# EAGLE design skpcbs custom uno (EAGLE 9.3.2)
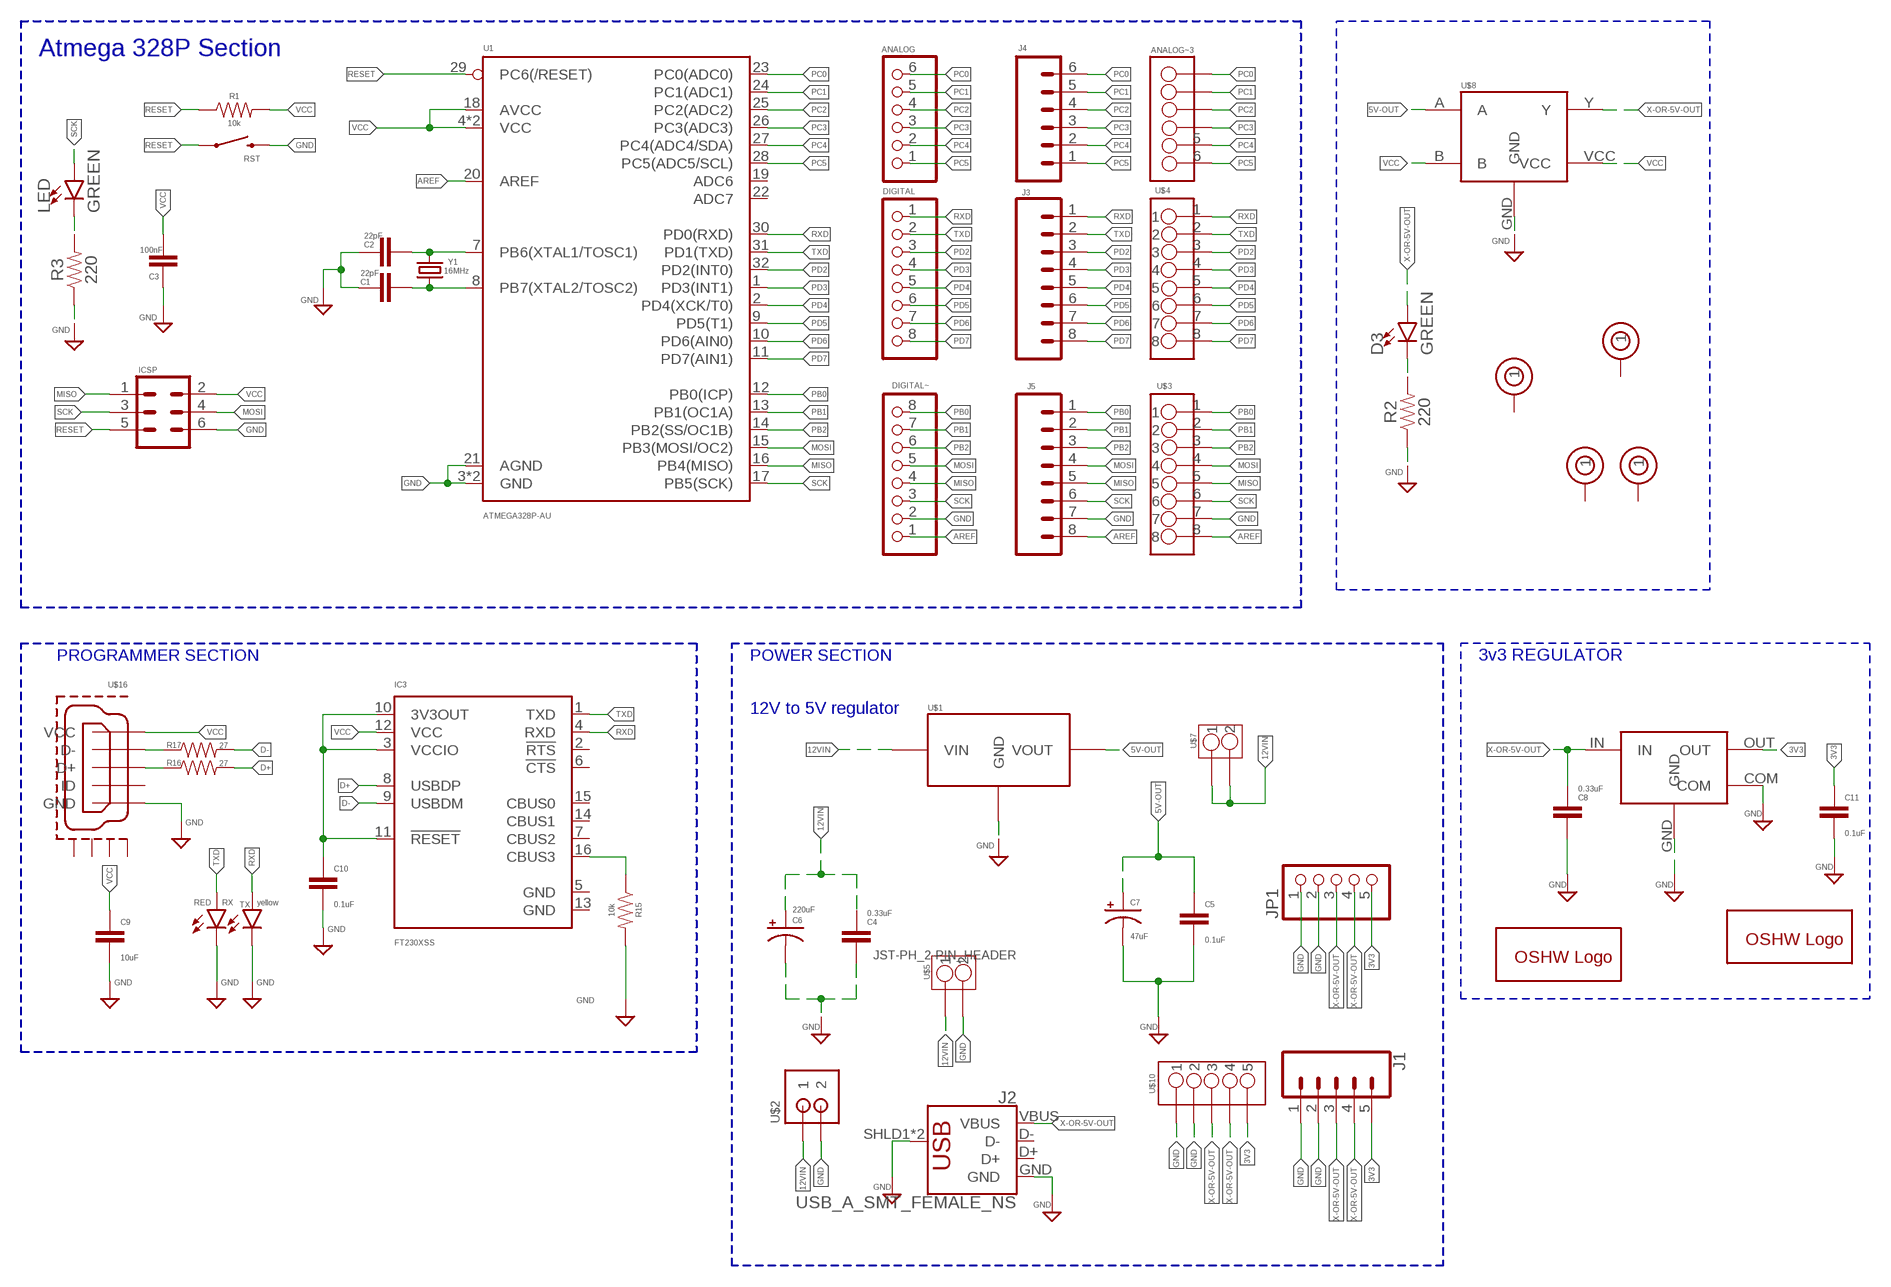
[diagram p0: schematic, sheet 1]

## Parts
ANALOG  PINHD-1X6  [1X06]
ANALOG~3  TERMINAL-BLOCKS-2.54MM-6PINS  [TERMINAL-BLOCK-2.54MM-6PINS]
C1  22pF  22PF-0603-50V-5%  [0603]
C2  22pF  22PF-0603-50V-5%  [0603]
C3  100nF  10NF-0603-50V-10%  [0603]
C4  0.33uF  0.1UF-0603-25V-5%  [0603]
C5  0.1uF  0.1UF-0603-25V-5%  [0603]
C6  220uF  CPOL-US153CLV-0605  [153CLV-0605]
C7  47uF  CPOL-US153CLV-0605  [153CLV-0605]
C8  0.33uF  0.1UF-0603-25V-5%  [0603]
C9  10uF  10UF-0603-6.3V-20%  [0603]
C10  0.1uF  0.1UF-0603-25V-(+80/-20%)  [0603]
C11  0.1uF  0.1UF-0603-25V-5%  [0603]
D3  GREEN  LED-GREEN0603  [LED-0603]
DIGITAL  PINHD-1X8  [1X08]
DIGITAL~  PINHD-1X8  [1X08]
GOLD_ORB_SM1  OSHWLOGOLOGO8MM  [OSHW_8MM]
GOLD_ORB_SM2  OSHWLOGOLOGO8MM  [OSHW_8MM]
IC3  FT230XSS  [SSOP16]
ICSP  CONN_03X2SHROUD  [2X3-SHROUDED]
J1  CONN_05NO_SILK  [1X05_NO_SILK]
J2  USB_A_SMT_FEMALE_NS  [USB-A-S-NOSILK-FEMALE]
J3  CONN_08NO_SILK_FEMALE_PTH  [1X08_NO_SILK]
J4  CONN_06NO_SILK_FEMALE_PTH  [1X06_NO_SILK]
J5  CONN_08NO_SILK_FEMALE_PTH  [1X08_NO_SILK]
JP1  PINHD-1X5  [1X05]
LED  GREEN  LED-GREEN1206  [LED-1206]
R1  10k  10KOHM-0603-1/10W-1%  [0603]
R2  220  220OHM-0603-1/10W-1%  [0603]
R3  220  220OHM-0603-1/10W-1%  [0603]
R15  10k  1.2MOHM-0603-1/10W-1%  [0603]
R16  27  27OHM-0603-1/10W-1%  [0603]
R17  27  27OHM-0603-1/10W-1%  [0603]
RST  MOMENTARY-SWITCH-SPST-SMD-5.2MM  [TACTILE_SWITCH_SMD_5.2MM]
RX  RED  LED-RED1206  [LED-1206]
TX  yellow  LED-RED1206  [LED-1206]
U1  ATMEGA328P-AU  ATMEGA328P_TQFP  [TQFP32-08]
U$1  L78M05CDT-TR  [L78M05CDT-TR]
U$2  JST-PH_2-PIN_HEADER  [JST_B2B-PH_HEADER]
U$3  TERMINAL-BLOCK-2.54MM-8PINS  [TERMINAL-BLOCK-2.54MM-8PINS]
U$4  TERMINAL-BLOCK-2.54MM-8PINS  [TERMINAL-BLOCK-2.54MM-8PINS]
U$5  TERMINAL-BLOCK-2.54MM-2PINS  [TERMINAL-BLOCK-2.54MM-2PIN]
U$6  3MM-THROUGH-HOLE  [3MM-THROUGH-HOLE]
U$7  TERMINAL-BLOCK-2.54MM-2PINS  [TERMINAL-BLOCK-2.54MM-2PIN]
U$8  NC7SZ86M5X  [NC7SZ86M5X]
U$9  UA78M33CDCYR  [UA78M33CDCYR]
U$10  TERMINAL-BLOCK-2.54MM-5PINS  [TERMINAL-BLOCK-2.54MM-5PINS]
U$11  3MM-THROUGH-HOLE  [3MM-THROUGH-HOLE]
U$12  3MM-THROUGH-HOLE  [3MM-THROUGH-HOLE]
U$13  3MM-THROUGH-HOLE  [3MM-THROUGH-HOLE]
U$16  MICRO-USB-RECEPTACLE47589-0001  [47589-0001]
Y1  16MHz  CRYSTAL-16MHZSMD-5X3.2  [CRYSTAL-SMD-5X3.2-4PAD]

## Nets
3V3: C11.1 J1.5 JP1.5 U$9.OUT U$10.5
5V-OUT: C5.1 C7.+ U$1.VOUT U$8.A
12VIN: C4.1 C6.+ U$1.VIN U$2.P1 U$5.1 U$7.1 U$7.2
AREF: DIGITAL~.1 J5.8 U1.20(AREF) U$3.8
D+: IC3.8(USBDP) R16.2
D-: IC3.9(USBDM) R17.2
GND: C1.2 C2.1 C3.2 C4.2 C5.2 C6.- C7.- C8.2 C9.2 C10.2 C11.2 DIGITAL~.2 ICSP.6 J1.1 J1.2 J2.GND J2.SHLD1(SHIELD) J2.SHLD2(SHIELD) J5.7 JP1.1 JP1.2 R2.1 R3.1 R15.2 RST.3 RX.C TX.C U1.3(GND) U1.5(GND) U1.21(AGND) U$1.GND U$2.P2 U$3.7 U$5.2 U$8.GND U$9.COM U$9.GND U$10.1 U$10.2 U$16.GND
MISO: DIGITAL~.4 ICSP.1 J5.5 U1.16(PB4(MISO)) U$3.5
MOSI: DIGITAL~.5 ICSP.4 J5.4 U1.15(PB3(MOSI/OC2)) U$3.4
N$1: C2.2 U1.7(PB6(XTAL1/TOSC1)) Y1.3
N$2: C1.1 U1.8(PB7(XTAL2/TOSC2)) Y1.1
N$3: LED.C R3.2
N$4: D3.C R2.2
N$18: IC3.16(CBUS3) R15.1
N$19: C10.1 IC3.3(VCCIO) IC3.10(3V3OUT) IC3.11(!RESET)
N$20: R16.1 U$16.D+
N$21: R17.1 U$16.D-
PB0: DIGITAL~.8 J5.1 U1.12(PB0(ICP)) U$3.1
PB1: DIGITAL~.7 J5.2 U1.13(PB1(OC1A)) U$3.2
PB2: DIGITAL~.6 J5.3 U1.14(PB2(SS/OC1B)) U$3.3
PC0: ANALOG.6 ANALOG~3.1 J4.6 U1.23(PC0(ADC0))
PC1: ANALOG.5 ANALOG~3.2 J4.5 U1.24(PC1(ADC1))
PC2: ANALOG.4 ANALOG~3.3 J4.4 U1.25(PC2(ADC2))
PC3: ANALOG.3 ANALOG~3.4 J4.3 U1.26(PC3(ADC3))
PC4: ANALOG.2 ANALOG~3.5 J4.2 U1.27(PC4(ADC4/SDA))
PC5: ANALOG.1 ANALOG~3.6 J4.1 U1.28(PC5(ADC5/SCL))
PD2: DIGITAL.3 J3.3 U1.32(PD2(INT0)) U$4.3
PD3: DIGITAL.4 J3.4 U1.1(PD3(INT1)) U$4.4
PD4: DIGITAL.5 J3.5 U1.2(PD4(XCK/T0)) U$4.5
PD5: DIGITAL.6 J3.6 U1.9(PD5(T1)) U$4.6
PD6: DIGITAL.7 J3.7 U1.10(PD6(AIN0)) U$4.7
PD7: DIGITAL.8 J3.8 U1.11(PD7(AIN1)) U$4.8
RESET: ICSP.5 R1.1 RST.1 U1.29(PC6(/RESET))
RXD: DIGITAL.1 IC3.4(RXD) J3.1 TX.A U1.30(PD0(RXD)) U$4.1
SCK: DIGITAL~.3 ICSP.3 J5.6 LED.A U1.17(PB5(SCK)) U$3.6
TXD: DIGITAL.2 IC3.1(TXD) J3.2 RX.A U1.31(PD1(TXD)) U$4.2
VCC: C3.1 C9.1 IC3.12(VCC) ICSP.2 R1.2 U1.4(VCC) U1.6(VCC) U1.18(AVCC) U$8.B U$8.VCC U$16.V-BUS(VCC)
X-OR-5V-OUT: C8.1 D3.A J1.3 J1.4 J2.VBUS JP1.3 JP1.4 U$8.Y U$9.IN U$10.3 U$10.4
Unconnected: IC3.2(!RTS) IC3.6(!CTS) IC3.7(CBUS2) IC3.14(CBUS1) IC3.15(CBUS0) J2.D+ J2.D- U1.19(ADC6) U1.22(ADC7) U$6.1 U$11.1 U$12.1 U$13.1 U$16.CASING1(GND1) U$16.CASING2(GND2) U$16.CASING3(GND3) U$16.CASING4(GND4) U$16.ID

## Buses
B$1
B$2
B$3
B$4
B$5

## Notes on the sheet
- Atmega 328P Section
- PROGRAMMER SECTION | POWER SECTION | 3v3 REGULATOR
- 12V to 5V regulator

## Power pins joined to a net without a drawn wire
GND: IC3.5(GND) IC3.13(GND)

## Library data of the parts
ANALOG = pinhead:PINHD-1X6: PIN HEADER
ANALOG~3 = Terminal Block 6 Pins:TERMINAL-BLOCKS-2.54MM-6PINS
C1 C2 = SparkFun-Capacitors:22PF: 22pF ceramic capacitors A capacitor is a passive two-terminal electrical component used to store electrical energy temporarily in an electric field.; PROD_ID: CAP-07876
C3 = SparkFun-Capacitors:10NF: 0.01uF/10nF/10,000pF ceramic capacitors A capacitor is a passive two-terminal electrical component used to store electrical energy temporarily in an electric field. CAP-09321; PROD_ID: CAP-00867; VALUE: 10nF
C4 C8 = SparkFun-Capacitors:0.1UF: 0.1µF ceramic capacitors A capacitor is a passive two-terminal electrical component used to store electrical energy temporarily in an electric field.; PROD_ID: CAP-08604; VALUE: 0.1uF
C5 C11 = SparkFun-Capacitors:0.1UF: 0.1µF ceramic capacitors A capacitor is a passive two-terminal electrical component used to store electrical energy temporarily in an electric field.; PROD_ID: CAP-08604
C6 C7 = rcl:CPOL-US: POLARIZED CAPACITOR, American symbol; SPICEPREFIX: C
C9 = SparkFun-Capacitors:10UF: 10.0µF ceramic capacitors A capacitor is a passive two-terminal electrical component used to store electrical energy temporarily in an electric field.; PROD_ID: CAP-11015
C10 = SparkFun-Capacitors:0.1UF: 0.1µF ceramic capacitors A capacitor is a passive two-terminal electrical component used to store electrical energy temporarily in an electric field.; PROD_ID: CAP-00810
D3 = SparkFun-LED:LED-GREEN: Green SMD LED Used in manufacturing of various products at SparkFun Packages: 0603 - SMD 0603 package [Product Link] <http://www.futureelectronics.com/en/technologies/semiconductors/optoelectronics/leds/Pages/9894312-LTST-C190GKT.aspx?CrossPart=HSMG-C190&IM=0> LilyPad 1206 - SMD1206 LilyPad package [Product Link] <http://www.futureelectronics.com/en/Technologies/Product.aspx?ProductID=IN150NGHARVATEKCORPORATION2049943&IM=0> 1206 - SMD1206 package [Product Link] <http://www.futureelectronics.com/en/technologies/semiconductors/optoelectronics/leds/Pages/8315665-LTST-C150KGKT.aspx?IM=0> 1206 Bottom Mount -SMD 1206 Bottom Mount [Product Link] <http://www.digikey.com/product-detail/en/lite-on-inc/LTST-C230KGKT/160-1456-1-ND/386854> SparkFun Products: Pro Mini 328 -5V <https://www.sparkfun.com/products/821> RedBoard <https://www.sparkfun.com/products/12757> MP3 Trigger <https://www.sparkfun.com/products/13720> Makey Makey <https://www.sparkfun.com/products/11076>; PROD_ID: DIO-00821
DIGITAL DIGITAL~ = pinhead:PINHD-1X8: PIN HEADER
GOLD_ORB_SM1 GOLD_ORB_SM2 = oshw:OSHWLOGO: The OSHW logo for PCB layout
IC3 = FT230XS:FT230XS: USB to BASIC UART IC Auto generated by make-symbol-device-package-bsdl.ulp Rev. 43 Source: Data sheet <http://www.ftdichip.com/Support/Documents/DataSheets/ICs/DS_FT230X.pdf>; AVAILABILITY: Unavailable; DESCRIPTION: I/F, USB2.0 FS TO BASIC UART, 16SSOP; USB Type: Transceiver; USB Version: 2.0; Data Rate: 3Mbaud; Supply Voltage Rang...; MF: FTDI, Future; MP: FT230XS; PACKAGE: SSOP-16 FTDI; PRICE: None
ICSP = SparkFun-Connectors:CONN_03X2: Multi connection point. Often used as Generic Header-pin footprint for 0.1 inch spaced/style header connections You can populate with any combo of single row headers, but if you'd like an exact match, check these: Header - 2x3 (Male, 0.1") <https://www.sparkfun.com/products/12807> (PRT-12807) Header - 2x3 (Female, 0.1") <https://www.sparkfun.com/products/13010> (PRT-13010) 2x3 Pin Shrouded Header <https://www.sparkfun.com/products/10877> (PRT-10877) On any of the 0.1 inch spaced packages, you can populate with these: Break Away Headers - Straight <https://www.sparkfun.com/products/116> (PRT-00116) Break Away Male Headers - Right Angle <https://www.sparkfun.com/products/553> (PRT-00553) Female Headers <https://www.sparkfun.com/products/115> (PRT-00115) Break Away Headers - Machine Pin <https://www.sparkfun.com/products/117> (PRT-00117) Break Away Female Headers - Swiss Machine Pin <https://www.sparkfun.com/products/743> (PRT-00743) Special note: the shrouded connector mates well with our 3x2 ribbon cables: Ribbon Crimp Connector - 6-pin (2x3, Female) <https://www.sparkfun.com/products/10651> (PRT-10651) Ribbon Cable - 6 wire (15ft) <https://www.sparkfun.com/products/10646> (PRT-10646); PROD_ID: CONN-10681; SF_ID: PRT_10877
J1 = SparkFun-Connectors:CONN_05: Multi connection point. Often used as Generic Header-pin footprint for 0.1 inch spaced/style header connections On any of the 0.1 inch spaced packages, you can populate with these: Break Away Headers - Straight <https://www.sparkfun.com/products/116> (PRT-00116) Break Away Male Headers - Right Angle <https://www.sparkfun.com/products/553> (PRT-00553) Female Headers <https://www.sparkfun.com/products/115> (PRT-00115) Break Away Headers - Machine Pin <https://www.sparkfun.com/products/117> (PRT-00117) Break Away Female Headers - Swiss Machine Pin <https://www.sparkfun.com/products/743> (PRT-00743) For SCREWTERMINALS and SPRING TERMINALS visit here: Screw Terimnals on SparkFun.com <https://www.sparkfun.com/search/results?term=Screw+Terminals> (5mm/3.5mm/2.54mm spacing) This device is also useful as a general connection point to wire up your design to another part of your project. Our various solder wires solder well into these plated through hole pads. Hook-Up Wire - Assortment (Stranded, 22 AWG) <https://www.sparkfun.com/products/11375> (PRT-11375) Hook-Up Wire - Assortment (Solid Core, 22 AWG) <https://www.sparkfun.com/products/11367> (PRT-11367) View the entire wire category on our website here <https://www.sparkfun.com/categories/141> Special notes: Molex polarized connector foot print use with SKU : PRT-08231 with associated crimp pins and housings. 1MM SMD Version SKU: PRT-10208
J2 = SparkFun-Connectors:USB_A: USB-A Connector Male and female variants, as well as PTH and SMT variants SparkFun Products: SparkFun XBee Explorer Dongle <https://www.sparkfun.com/products/11697> PTH Male SparkFun MicroView-USB Programmer <https://www.sparkfun.com/products/12924> SMT Male SparkFun USB Type A Female Breakout <https://www.sparkfun.com/products/12700> SMT Female; PROD_ID: CONN-09520; SF_ID: PRT-09011
J3 J5 = SparkFun-Connectors:CONN_08: Multi connection point. Often used as Generic Header-pin footprint for 0.1 inch spaced/style header connections On any of the 0.1 inch spaced packages, you can populate with these: Break Away Headers - Straight <https://www.sparkfun.com/products/116> (PRT-00116) Break Away Male Headers - Right Angle <https://www.sparkfun.com/products/553> (PRT-00553) Female Headers <https://www.sparkfun.com/products/115> (PRT-00115) Break Away Headers - Machine Pin <https://www.sparkfun.com/products/117> (PRT-00117) Break Away Female Headers - Swiss Machine Pin <https://www.sparkfun.com/products/743> (PRT-00743) Arduino Stackable Header - 8 Pin <https://www.sparkfun.com/products/9279> (PRT-09279) For SCREWTERMINALS and SPRING TERMINALS visit here: Screw Terimnals on SparkFun.com <https://www.sparkfun.com/search/results?term=Screw+Terminals> (5mm/3.5mm/2.54mm spacing) This device is also useful as a general connection point to wire up your design to another part of your project. Our various solder wires solder well into these plated through hole pads. Hook-Up Wire - Assortment (Stranded, 22 AWG) <https://www.sparkfun.com/products/11375> (PRT-11375) Hook-Up Wire - Assortment (Solid Core, 22 AWG) <https://www.sparkfun.com/products/11367> (PRT-11367) View the entire wire category on our website here <https://www.sparkfun.com/categories/141> Special notes: Molex polarized connector foot print use with SKU : PRT-08231 with associated crimp pins and housings. 1MM SMD Version SKU: PRT-10208 NOTES ON THE VARIANTS LOCK and LOCK_LONGPADS... This footprint was designed to help hold the alignment of a through-hole component (i.e. 6-pin header) while soldering it into place. You may notice that each hole has been shifted either up or down by 0.005 of an inch from it's more standard position (which is a perfectly straight line). This slight alteration caused the pins (the squares in the middle) to touch the edges of the holes. Because they are alternating, it causes a "brace" to hold the component in place. 0.005 has proven to be the perfect amount of "off-center" position when using our standard breakaway headers. Although looks a little odd when you look at the bare footprint, once you have a header in there, the alteration is very hard to notice. Also,if you push a header all the way into place, it is covered up entirely on the bottom side.; PROD_ID: CONN-08438
J4 = SparkFun-Connectors:CONN_06: Multi connection point. Often used as Generic Header-pin footprint for 0.1 inch spaced/style header connections On any of the 0.1 inch spaced packages, you can populate with these: Break Away Headers - Straight <https://www.sparkfun.com/products/116> (PRT-00116) Break Away Male Headers - Right Angle <https://www.sparkfun.com/products/553> (PRT-00553) Female Headers <https://www.sparkfun.com/products/115> (PRT-00115) Break Away Headers - Machine Pin <https://www.sparkfun.com/products/117> (PRT-00117) Break Away Female Headers - Swiss Machine Pin <https://www.sparkfun.com/products/743> (PRT-00743) Arduino Stackable Header - 6 Pin <https://www.sparkfun.com/products/9280> (PRT-09280) For SCREWTERMINALS and SPRING TERMINALS visit here: Screw Terimnals on SparkFun.com <https://www.sparkfun.com/search/results?term=Screw+Terminals> (5mm/3.5mm/2.54mm spacing) This device is also useful as a general connection point to wire up your design to another part of your project. Our various solder wires solder well into these plated through hole pads. Hook-Up Wire - Assortment (Stranded, 22 AWG) <https://www.sparkfun.com/products/11375> (PRT-11375) Hook-Up Wire - Assortment (Solid Core, 22 AWG) <https://www.sparkfun.com/products/11367> (PRT-11367) View the entire wire category on our website here <https://www.sparkfun.com/categories/141>; PROD_ID: CONN-08437
JP1 = pinhead:PINHD-1X5: PIN HEADER
LED = SparkFun-LED:LED-GREEN: Green SMD LED Used in manufacturing of various products at SparkFun Packages: 0603 - SMD 0603 package [Product Link] <http://www.futureelectronics.com/en/technologies/semiconductors/optoelectronics/leds/Pages/9894312-LTST-C190GKT.aspx?CrossPart=HSMG-C190&IM=0> LilyPad 1206 - SMD1206 LilyPad package [Product Link] <http://www.futureelectronics.com/en/Technologies/Product.aspx?ProductID=IN150NGHARVATEKCORPORATION2049943&IM=0> 1206 - SMD1206 package [Product Link] <http://www.futureelectronics.com/en/technologies/semiconductors/optoelectronics/leds/Pages/8315665-LTST-C150KGKT.aspx?IM=0> 1206 Bottom Mount -SMD 1206 Bottom Mount [Product Link] <http://www.digikey.com/product-detail/en/lite-on-inc/LTST-C230KGKT/160-1456-1-ND/386854> SparkFun Products: Pro Mini 328 -5V <https://www.sparkfun.com/products/821> RedBoard <https://www.sparkfun.com/products/12757> MP3 Trigger <https://www.sparkfun.com/products/13720> Makey Makey <https://www.sparkfun.com/products/11076>; PROD_ID: DIO-00862
R1 = SparkFun-Resistors:10KOHM: 10kΩ resistor A resistor is a passive two-terminal electrical component that implements electrical resistance as a circuit element. Resistors act to reduce current flow, and, at the same time, act to lower voltage levels within circuits. - Wikipedia; PROD_ID: RES-00824
R2 R3 = SparkFun-Resistors:220OHM: 220Ω resistor A resistor is a passive two-terminal electrical component that implements electrical resistance as a circuit element. Resistors act to reduce current flow, and, at the same time, act to lower voltage levels within circuits. - Wikipedia; PROD_ID: RES-07861
R15 = SparkFun-Resistors:1.2MOHM: 1.2MΩ resistor A resistor is a passive two-terminal electrical component that implements electrical resistance as a circuit element. Resistors act to reduce current flow, and, at the same time, act to lower voltage levels within circuits. - Wikipedia; PROD_ID: RES-10055; VALUE: 1.2M
R16 R17 = SparkFun-Resistors:27OHM: 27Ω resistor A resistor is a passive two-terminal electrical component that implements electrical resistance as a circuit element. Resistors act to reduce current flow, and, at the same time, act to lower voltage levels within circuits. - Wikipedia; PROD_ID: RES-09334
RST = SparkFun-Switches:MOMENTARY-SWITCH-SPST: Momentary Switch (Pushbutton) - SPST Normally-open (NO) SPST momentary switches (buttons, pushbuttons). Variants PTH-12MM - 12mm square, through-hole Momentary Pushbutton Switch - 12mm Square <https://www.sparkfun.com/products/9190> (COM-09190) PTH-6.0MM, PTH-6.0MM-KIT - 6.0mm square, through-hole Mini Pushbutton Switch <https://www.sparkfun.com/products/97> (COM-00097) KIT package intended for soldering kit's - only one side of pads' copper is exposed. PTH-RIGHT-ANGLE-KIT - Right-angle, through-hole Right Angle Tactile Button <https://www.sparkfun.com/products/10791> - Used on SparkFun BigTime Watch Kit <https://www.sparkfun.com/products/11734> SMD-12MM - 12mm square, surface-mount Tactile Button - SMD (12mm) <https://www.sparkfun.com/products/12993> (COM-12993) Used on SparkFun PicoBoard <https://www.sparkfun.com/products/11888> SMD-4.5MM - 4.5mm Square Trackball Switch Used on SparkFun Blackberry Trackballer Breakout <https://www.sparkfun.com/products/13169> SMD-4.6MMX2.8MM - 4.60mm x 2.80mm, surface mount Used on SparkFun SAMD21 Mini Breakout <https://www.sparkfun.com/products/13664> SMD-5.2MM, SMD-5.2-REDUNDANT - 5.2mm square, surface-mount Mini Pushbutton Switch - SMD <https://www.sparkfun.com/products/8720> (COM-08720) Used on Arduino Pro Mini <https://www.sparkfun.com/products/11114> REDUNDANT package connects both switch circuits together SMD-6.0X3.5MM - 6.0 x 3.5mm, surface mount Momentary Reset Switch SMD <https://www.sparkfun.com/products/8229> (COM-08229) SMD-6.2MM-TALL - 6.2mm square, surface mount Tactile Button - SMD (6mm) <https://www.sparkfun.com/products/12992> Used on SparkFun Digital Sandbox <https://www.sparkfun.com/products/12651> SMD-RIGHT-ANGLE - Right-angle, surface mount Used on SparkFun Block for Intel® Edison - Arduino <https://www.sparkfun.com/products/13036>; PROD_ID: SWCH-08247; SF_SKU: COM-08720
RX = SparkFun-LED:LED-RED: Red SMD LED Used in manufacturing of most products at SparkFun Packages: 0603 - SMD 0603 package [Product Link] <http://docs.avagotech.com/docs/AV02-0551EN> 0603 SMART - SMD 0603 SMART package ( more efficient and expensive)[Product Link] <http://www.osram-os.com/Graphics/XPic2/00077099_0.pdf> 1206 - SMD1206 package [Product Link] <https://www.sparkfun.com/datasheets/DevTools/LilyPad/Q150OVS4.pdff> SparkFun Products: Pro Mini 328 -5V <https://www.sparkfun.com/products/821> RedBoard <https://www.sparkfun.com/products/12757> IOIO-OTG <https://www.sparkfun.com/products/13613>; PROD_ID: DIO-09912
TX = SparkFun-LED:LED-RED: Red SMD LED Used in manufacturing of most products at SparkFun Packages: 0603 - SMD 0603 package [Product Link] <http://docs.avagotech.com/docs/AV02-0551EN> 0603 SMART - SMD 0603 SMART package ( more efficient and expensive)[Product Link] <http://www.osram-os.com/Graphics/XPic2/00077099_0.pdf> 1206 - SMD1206 package [Product Link] <https://www.sparkfun.com/datasheets/DevTools/LilyPad/Q150OVS4.pdff> SparkFun Products: Pro Mini 328 -5V <https://www.sparkfun.com/products/821> RedBoard <https://www.sparkfun.com/products/12757> IOIO-OTG <https://www.sparkfun.com/products/13613>; PROD_ID: DIO-09912; VALUE: RED
U1 = SparkFun-IC-Microcontroller:ATMEGA328P_TQFP: Popular 328P in QFP Storefront component: ATmega328 - TQFP <https://www.sparkfun.com/products/13448> (COM-13448) Datasheet <http://www.sparkfun.com/datasheets/Components/SMD/ATMega328.pdf> SparkFun Products SparkFun RedBoard - Programmed with Arduino <https://www.sparkfun.com/products/12757> (DEV-12757) Arduino Pro Mini 328 - 5V/16MHz <https://www.sparkfun.com/products/11113> (DEV-11113) Arduino Pro Mini 328 - 3.3V/8MHz <https://www.sparkfun.com/products/11114> (DEV-11114) SparkFun OpenLog <https://www.sparkfun.com/products/13712> (DEV-13712) SparkFun MicroView - OLED Arduino Module <https://www.sparkfun.com/products/12923> (DEV-12923) SparkFun Digital Sandbox <https://www.sparkfun.com/products/12651> (DEV-12651) SparkFun PicoBoard <https://www.sparkfun.com/products/11888> (WIG-11888) Arduino Fio <https://www.sparkfun.com/products/10116> (DEV-10116) LilyPad Arduino 328 Main Board <https://www.sparkfun.com/products/13342> (DEV-13342) SparkFun RedStick <https://www.sparkfun.com/products/13741> (DEV-13741) LilyPad MP3 <https://www.sparkfun.com/products/11013> (DEV-11013) LilyPad Arduino SimpleSnap <https://www.sparkfun.com/products/10941> (DEV-10941) SparkFun Stepoko <https://www.sparkfun.com/products/13899> (ROB-13899) SparkFun Geiger Counter <https://www.sparkfun.com/products/11345> (SEN-11345) SparkFun EL Sequencer <https://www.sparkfun.com/products/12781> (COM-12781) Arduino Pro 328 - 5V/16MHz <https://www.sparkfun.com/products/10915> (DEV-10915) CryptoCape <https://www.sparkfun.com/products/12773> (DEV-12773) SparkFun IR Thermometer Evaluation Board - MLX90614 <https://www.sparkfun.com/products/10740> (SEN-10740) SparkFun RedBot Mainboard <https://www.sparkfun.com/products/12097> (ROB-12097) Arduino Pro 328 - 3.3V/8MHz <https://www.sparkfun.com/products/10914> (DEV-10914) SparkFun Block for Intel® Edison - Arduino <https://www.sparkfun.com/products/13036> (DEV-13036) SparkFun Simon Says - Surface Mount Soldering Kit <https://www.sparkfun.com/products/10935> (KIT-10935) SparkFun 7-Segment Serial Display - Red <https://www.sparkfun.com/products/11441> (COM-11441) SparkFun 7-Segment Serial Display - White <https://www.sparkfun.com/products/11629> (COM-11629) SparkFun 7-Segment Serial Display - Yellow <https://www.sparkfun.com/products/11443> (COM-11443) SparkFun 7-Segment Serial Display - Kelly Green <https://www.sparkfun.com/products/11440> (COM-11440) SparkFun 7-Segment Serial Display - Blue <https://www.sparkfun.com/products/11442> (COM-11442) SparkFun OpenSegment Serial Display - 20mm (Blue) <https://www.sparkfun.com/products/11647> (COM-11647) SparkFun OpenSegment Serial Display - 20mm (Green) <https://www.sparkfun.com/products/11646> (COM-11646) SparkFun OpenSegment Serial Display - 20mm (White) <https://www.sparkfun.com/products/11648> (COM-11648) SparkFun OpenSegment Serial Display - 20mm (Red) <https://www.sparkfun.com/products/11644> (COM-11644) SparkFun OpenSegment Serial Display - 20mm (Yellow) <https://www.sparkfun.com/products/11645> (COM-11645) SparkFun OpenSegment Shield <https://www.sparkfun.com/products/13190> (DEV-13190); PROD_ID: IC-09069; VALUE: ATMEGA328P_TQFP
U$1 = LM78M05CDT-TR:L78M05CDT-TR
U$2 = srg:JST-PH_2-PIN_HEADER: 2-pin JST PH Shrouded Header, top entry P/N B2B-PH-K-S Mating connector PHR-2 Mating cable assembly: Sparkfun PRT-09914 <http://www.sparkfun.com/products/9914>
U$3 U$4 = Terminal Block 8 Pins:TERMINAL-BLOCK-2.54MM-8PINS: Terminal Block 2.54mm 8 Pins Terminal Blocks 8 Pins
U$5 U$7 = Terminal Block 2 Pins :TERMINAL-BLOCK-2.54MM-2PINS
U$6 U$11-U$13 = Through_holes:3MM-THROUGH-HOLE
U$8 = X-OR-NC7SZ86M5X:NC7SZ86M5X
U$9 = 3v3Regulator:UA78M33CDCYR
U$10 = Terminal Block 5 pins:TERMINAL-BLOCK-2.54MM-5PINS
U$16 = con-molex-usb:MICRO-USB-RECEPTACLE: MICRO USB RECEPTACLES Micro-USB Receptacles, SMT, Lead-Free from MOLEX <http://www.molex.com/>. (C) 2014 Tomasz Boleslaw CEDRO, cederom@tlen.pl, http://www.tomek.cedro.info. Version 0.1 (2014-01-17): Initial release. Version 0.2 (2014-02-06): Updated 47589-0001 footprint pins/pads/milling. Following devices are included: 1. 47589-0001 Micro-USB AB Receptacle, Bottom Mount, SMT, Lead-Free <http://www.molex.com/molex/products/datasheet.jsp?part=active/0475890001_IO_CONNECTORS.xml> (Technical Drawing <http://www.molex.com/pdm_docs/sd/475890001_sd.pdf>).
Y1 = SparkFun-Clocks:CRYSTAL-16MHZ: 16MHz Crystal Digikey Example <http://www.digikey.com/product-search/en?keywords=535-9122-1-ND> Frequency: 16MHz Frequency Stability: ±50ppm Frequency Tolerance: ±20ppm Load Capacitance: 18pF SparkFun Products: Pro Micro -5V/16MHz <https://www.sparkfun.com/products/12640> SparkFun Serial Enabled LCD Kit <https://www.sparkfun.com/products/10097>; PROD_ID: XTAL-08218; SF_ID: COM-00094

## Board
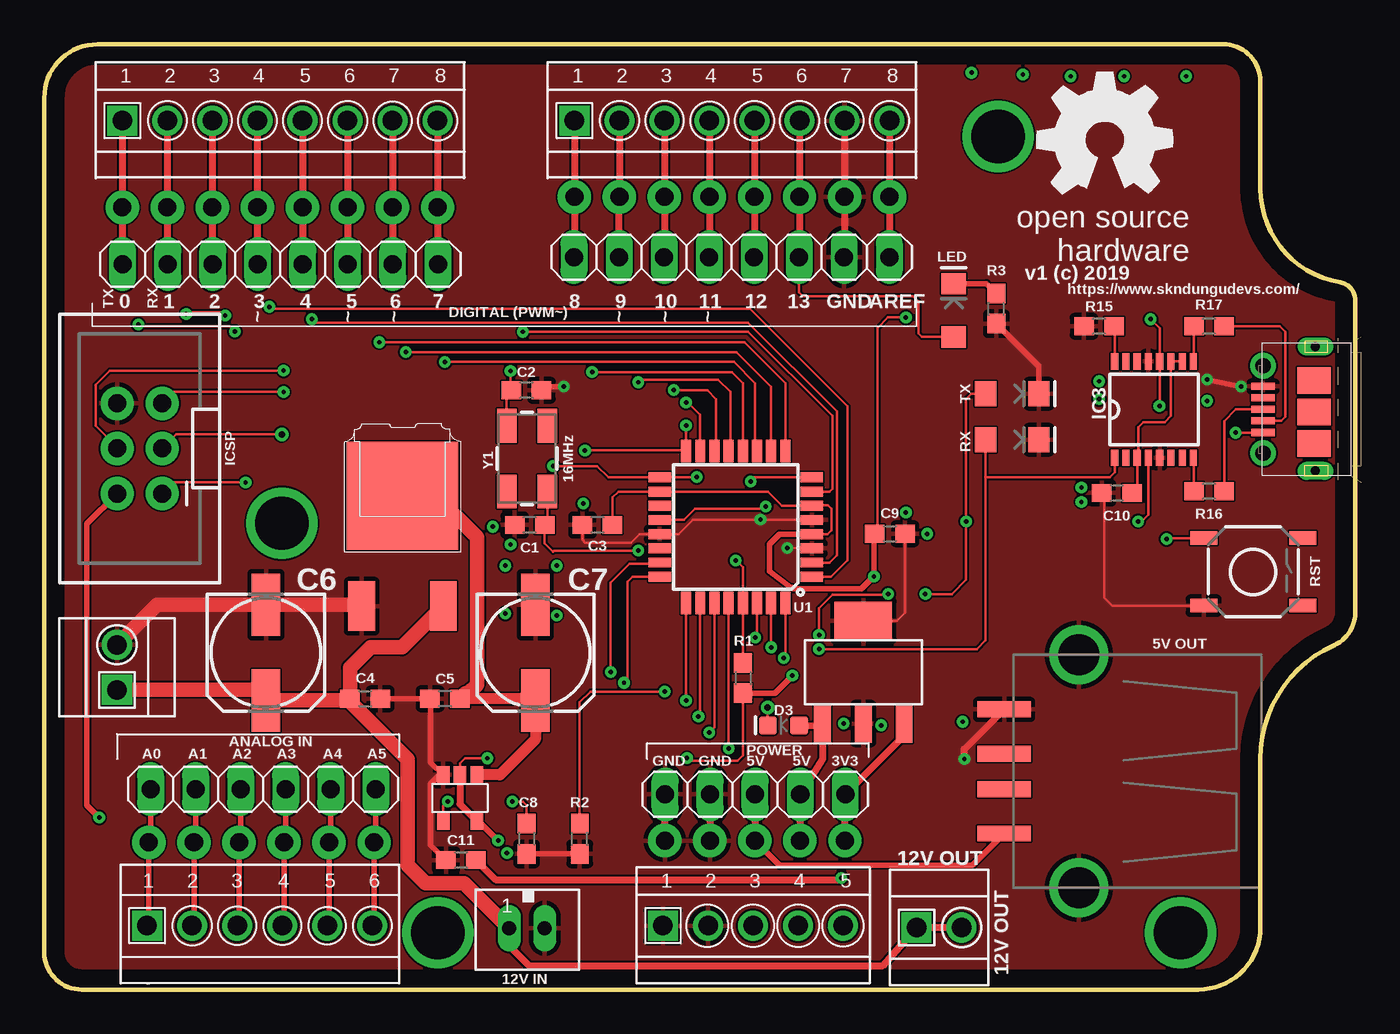
[diagram p1: board, top side]
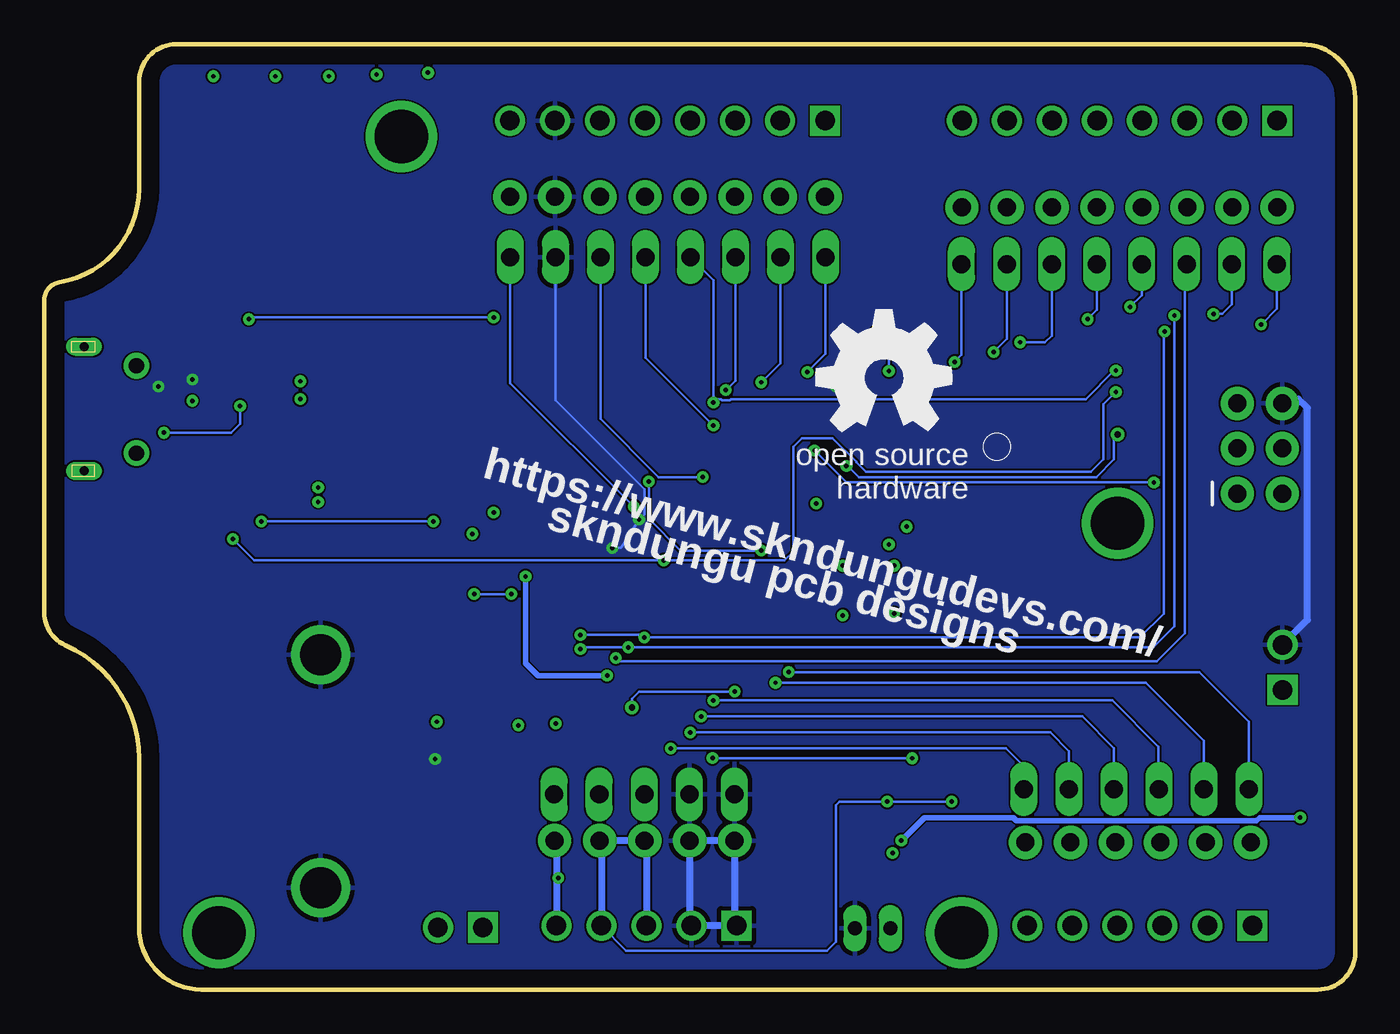
[diagram p2: board, bottom side, seen from below]

Size 73.95 x 53.3 mm. Coordinates in mm from the lower left corner, seen from the top.
Outline: 72.76,19.42 arc66 73.94,21.25 73.94,38.89 arc81 73.1,39.88 arc-81 68.6,45.16 68.6,51.2 arc90 66.5,53.3 3,53.3 arc90 0,50.3 0,2.1 arc90 2.1,0 65.1,0 arc90 68.6,3.5 68.6,13.03 arc-66 72.76,19.42
Copper layers (1*16): Top 0.035mm / dielectric 1.5mm / Bottom 0.035mm
Design rules "default *": minimum track width 4mil, minimum drill 0.25mm, track to track 4mil, track to pad 4mil, pad to pad 4mil, via to via 4mil, smd to smd 4mil, copper to edge 40mil, drill to drill 6mil, minimum pad ring 10mil, minimum via ring 8mil, stop-mask expansion 4mil, vias tented up to drill 0mil, thermal gap 10mil

### Footprints (pad centres in the part's own frame; a part is rotated, then mirrored left to right if it is on the bottom)
1X06 = drill 1.016 long: 1 -6.35,0; 2 -3.81,0; 3 -1.27,0; 4 1.27,0; 5 3.81,0; 6 6.35,0
TERMINAL-BLOCK-2.54MM-6PINS = drill 1.1 pad 1.7 square: 1 0,0 | drill 1.1 pad 1.7: 2 2.54,0; 3 5.08,0; 4 7.62,0; 5 10.16,0; 6 12.7,0
0603 = smd 1.1 x 1: 1 -0.85,0; 2 0.85,0
153CLV-0605 = smd 3.5 x 1.6: + 2.7,0; - -2.7,0
LED-0603 = smd 1 x 1: A -0.877,0; C 0.877,0
1X08 = drill 1.016 long: 1 -8.89,0; 2 -6.35,0; 3 -3.81,0; 4 -1.27,0; 5 1.27,0; 6 3.81,0; 7 6.35,0; 8 8.89,0
SSOP16 = smd 0.914 x 0.406: 1 -2.718,2.223; 2 -2.718,1.587; 3 -2.718,0.953; 4 -2.718,0.318; 5 -2.718,-0.318; 6 -2.718,-0.953; 7 -2.718,-1.587; 8 -2.718,-2.223; 9 2.718,-2.223; 10 2.718,-1.587; 11 2.718,-0.953; 12 2.718,-0.318; 13 2.718,0.318; 14 2.718,0.953; 15 2.718,1.587; 16 2.718,2.223
2X3-SHROUDED = drill 1.016 pad 1.88: 1 -1.27,2.54; 2 1.27,2.54; 3 -1.27,0; 4 1.27,0; 5 -1.27,-2.54; 6 1.27,-2.54
1X05_NO_SILK = drill 1.016 pad 1.88: 1 0,0; 2 2.54,0; 3 5.08,0; 4 7.62,0; 5 10.16,0
USB-A-S-NOSILK-FEMALE = smd 3 x 0.9: D+ 6.752,-1; D- 6.752,1; GND 6.752,-3.5; VBUS 6.752,3.5 | drill 2.311: SHLD1 2.54,-6.566; SHLD2 2.54,6.566
1X08_NO_SILK = drill 1.016 pad 1.88: 1 0,0; 2 2.54,0; 3 5.08,0; 4 7.62,0; 5 10.16,0; 6 12.7,0; 7 15.24,0; 8 17.78,0
1X06_NO_SILK = drill 1.016 pad 1.88: 1 0,0; 2 2.54,0; 3 5.08,0; 4 7.62,0; 5 10.16,0; 6 12.7,0
1X05 = drill 1.016 long: 1 -5.08,0; 2 -2.54,0; 3 0,0; 4 2.54,0; 5 5.08,0
LED-1206 = smd 1.2 x 1.4: A -1.5,0; C 1.5,0
TACTILE_SWITCH_SMD_5.2MM = smd 1.524 x 0.762: 1 -2.794,1.905; 2 2.794,1.905; 3 -2.794,-1.905; 4 2.794,-1.905
TQFP32-08 = smd 1.27 x 0.559: 1 -4.293,2.8; 2 -4.293,2; 3 -4.293,1.2; 4 -4.293,0.4; 5 -4.293,-0.4; 6 -4.293,-1.2; 7 -4.293,-2; 8 -4.293,-2.8; 17 4.293,-2.8; 18 4.293,-2; 19 4.293,-1.2; 20 4.293,-0.4; 21 4.293,0.4; 22 4.293,1.2; 23 4.293,2; 24 4.293,2.8 | smd 0.559 x 1.27: 9 -2.8,-4.293; 10 -2,-4.293; 11 -1.2,-4.293; 12 -0.4,-4.293; 13 0.4,-4.293; 14 1.2,-4.293; 15 2,-4.293; 16 2.8,-4.293; 25 2.8,4.293; 26 2,4.293; 27 1.2,4.293; 28 0.4,4.293; 29 -0.4,4.293; 30 -1.2,4.293; 31 -2,4.293; 32 -2.8,4.293
L78M05CDT-TR = smd 1.5 x 2.8: GND -2.3,-9.278; VIN 2.3,-9.278 | smd 6.3 x 6.1: VOUT 0,-3.048
JST_B2B-PH_HEADER = drill 0.8 long: P1 1.075,0.048; P2 -0.925,0.048
TERMINAL-BLOCK-2.54MM-8PINS = drill 1.1 pad 1.7 square: 1 0,0 | drill 1.1 pad 1.7: 2 2.54,0; 3 5.08,0; 4 7.62,0; 5 10.16,0; 6 12.7,0; 7 15.24,0; 8 17.78,0
TERMINAL-BLOCK-2.54MM-2PIN = drill 1.1 pad 1.7 square: 1 0,0 | drill 1.1 pad 1.7: 2 2.54,0
3MM-THROUGH-HOLE = drill 3: 1 0,0
NC7SZ86M5X = smd 0.7 x 1: A -1,-1.2; B -0.05,-1.2; GND 0.9,-1.2; VCC -1,1.4; Y 0.9,1.4
UA78M33CDCYR = smd 3.25 x 2.15: COM 0,5.8 | smd 0.95 x 2.15: GND 0,0; IN -2.3,0; OUT 2.3,0
TERMINAL-BLOCK-2.54MM-5PINS = drill 1.1 pad 1.7 square: 1 0,0 | drill 1.1 pad 1.7: 2 2.54,0; 3 5.08,0; 4 7.62,0; 5 10.16,0
47589-0001 = drill 0.5 pad 0.95 long: CASING1 7.25,3; CASING2 0.25,3 | drill 0.85 pad 1.45: CASING3 6.251,0.048; CASING4 1.321,0.048 | smd 0.4 x 1.35: D+ 3.786,0.048; D- 4.436,0.048; GND 2.486,0.048; ID 3.136,0.048; V-BUS 5.086,0.048 | smd 1.5 x 1.9: P$1 2.159,2.921; P$2 3.937,2.921; P$3 5.715,2.921
CRYSTAL-SMD-5X3.2-4PAD = smd 1.9 x 1.1: 1 -1.85,-1.15; 2 1.85,-1.15; 3 1.85,1.15; 4 -1.85,1.15

### Placement (x,y rotation side)
ANALOG  12.34,11.3 180 top
ANALOG~3  5.8,3.6 0 top
C1  27.38,26.2 180 top
C2  27.19,33.8 180 top
C3  31.2,26.2 180 top
C4  18.1,16.4 0 top
C5  22.6,16.4 180 top
C6  12.5,19 270 top
C7  27.7,19 270 top
C8  27.2,8.5 270 top
C9  47.7,25.7 0 top
C10  60.5,28 180 top
C11  23.5,7.3 180 top
D3  41.7,14.9 180 top
DIGITAL  13.31,40.9 0 top
DIGITAL~  38.77,41.3 180 top
GOLD_ORB_SM1  26.6,34.5 0 bottom
GOLD_ORB_SM2  59.8,47.9 0 top
IC3  62.6,32.7 90 top
ICSP  5.38,30.51 180 top
J1  35,8.4 0 top
J2  60.9,12.3 180 top
J3  4.4,44.1 0 top
J4  18.6,8.3 180 top
J5  29.9,44.7 0 top
JP1  40.1,11 0 top
LED  51.3,38.3 90 top
R1  39.41,17.56 270 top
R2  30.2,8.5 90 top
R3  53.7,38.4 90 top
R15  59.5,37.4 180 top
R16  65.7,28.1 180 top
R17  65.7,37.4 180 top
RST  68.19,23.55 0 top
RX  54.6,31 0 top
TX  54.6,33.6 0 top
U1  39,26.08 180 top
U$1  20.2,30.9 0 top
U$2  27.3,3.5 180 top
U$3  29.9,49 0 top
U$4  4.4,49 0 top
U$5  4.1,16.9 90 top
U$6  53.8,48.1 0 top
U$7  49.2,3.5 0 top
U$8  23.4,10.9 180 top
U$9  46.2,15 0 top
U$10  34.9,3.6 0 top
U$11  64.1,3.2 0 top
U$12  13.4,26.3 0 top
U$13  22.2,3.2 0 top
U$16  68.7,36.5 270 top
Y1  27.23,29.94 90 top

### Tracks (layer width: path | path; a pad name or v marks a point on that pad's centre or on a via)
3V3  (via drill 0.25)
  Top 0.406: U$9.OUT 48.5,14.32 JP1.5 45.16,10.98 J1.5 | C11.1 25.45,6.2 44.86,6.2 v44.96,6.3
  Bottom 0.406: J1.5 45.06,8.3 45.06,6.4 v44.96,6.3 45.06,6.2 U$10.5
5V-OUT
  Top 0.61: U$8.A 25.7,12.1 27.7,14.1 C7.+ 27.6,16.4 C5.1
  Top 0.813: U$1.VOUT 22.05,27.85 24.4,25.5 24.4,17.2 23.9,16.7 23.75,16.7 C5.1
12VIN
  Top 0.406: U$2.P1 26.2,2.5 27.35,1.35 47.3,1.35 U$7.1 U$7.2
  Top 0.813: C4.1 17.15,16.3 C6.+ 11.9,16.9 U$5.1 | U$1.VIN 20.18,19.3 18.4,19.3 17.25,18.15 C4.1 | C4.1 17.25,16.23 20.5,12.98 20.5,7 21.5,6 23.68,6 U$2.P1
AREF  (via drill 0.25)
  Top 0.152: U1.20 36.08,26.48 36.7,27.1 40.56,27.1 v40.7,27.24
  Top 0.406: U$3.8 J5.8 47.68,41.32 DIGITAL~.1
  Bottom 0.152: DIGITAL~.1 47.66,34.2 v40.7,27.24
D+
  Top 0.152: R16.2 64.85,29.95 IC3.8
D-
  Top 0.152: R17.2 64.85,35.45 IC3.9
GND  (via drill 0.25)
  Top 0.152: v40.4,26.5 40.42,26.48 40.5,26.48 | 40.5,26.48 U1.5 | C9.2 48.55,21.25 48.1,20.8 U$9.COM | C3.2 30.35,25.35 30.5,25.2 33.1,25.2 33.58,25.68 U1.21 35.78,25.68 36.6,26.5 40.48,26.5 40.5,26.48 | RST.3 60.26,21.64 59.8,22.1 59.8,27.85 | U1.3 v41.9,24.9
  Top 0.305: C8.2 R2.1 | C11.2 21.8,8.15 21.8,11.6 22.3,12.1 U$8.GND 21.8,12.8 21.8,16.35 C5.2 C4.2 | v29.3,34 28.6,34 C2.1 | v67.5,34 v65.6,34.4 | R3.1 56.1,35.15 TX.C
  Top 0.406: JP1.2 37.56,8.42 J1.2 | J1.1 35,10.98 JP1.1 | U$3.7 J5.7 45.14,41.32 DIGITAL~.2 | J2.GND 51.9,13.55 v51.9,13
  Top 0.813: U$5.2 6.36,21.7 C6.- 17.82,21.7 U$1.GND
  Bottom 0.152: DIGITAL~.2 45.12,33.22 40.1,28.2 40.1,26.8 v40.4,26.5 41.4,24.9 v41.9,24.9
  Bottom 0.406: U$5.2 2.7,20.84 2.7,32.8 3.2,33.3 3.86,33.3 ICSP.6 | J1.2 37.54,3.7 U$10.2 U$10.1 35,3.7 J1.1 J1.2
  pour Top: 0,3.5 0,50.4 0.1,51 0.3,51.7 0.9,52.4 1.4,52.9 2.5,53.3 3.1,53.3 66.8,53.3 67.3,53.2 67.9,52.8 68.2,52.4 68.5,51.9 68.6,51.3 68.6,50.5 68.6,45.2 68.7,44.4 68.8,43.7 69,43.1 69.5,42.2 70.2,41.4 70.9,40.8 71.4,40.5 72.2,40.1 73.2,39.9 73.7,39.5 74,38.9 74,37.6 74,22.5 74,21.1 73.7,20.4 73.4,19.8 72.8,19.5 72.2,19.1 71.2,18.4 70.6,18 69.9,17.1 69.2,15.8 68.8,14.6 68.6,13.8 68.6,12.4 68.6,3.5 68.5,2.8 68.3,2.1 67.9,1.4 67.3,0.8 66.6,0.3 65.8,0.1 65,0 63.8,0 1.9,0 1.2,0.2 0.8,0.5 0.3,1.1 0,1.9 0,3.2
  pour Bottom: 0,5.1 0,50.1 0.1,51 0.5,51.9 1,52.5 1.8,53 2.8,53.3 3.8,53.3 66.6,53.3 67.6,53.1 68.2,52.3 68.6,51.5 68.6,44.6 68.8,43.7 69.3,42.5 70.3,41.2 71.1,40.6 72.2,40.1 73.4,39.7 73.8,39.5 74,38.3 73.9,21.8 73.9,21.1 73.8,20.5 73.5,20 72.9,19.5 71.5,18.7 70.7,18.1 70,17.2 69.2,16 68.8,14.5 68.7,13.5 68.6,12.2 68.6,4.5 68.6,3.3 68.4,2.3 67.9,1.4 67.2,0.7 66.4,0.2 65.4,0 64.7,0 2.2,0 1.5,0.1 0.9,0.4 0.4,0.9 0.1,1.5 0,1.9 0,2.9
MISO  (via drill 0.25)
  Top 0.152: U1.16 36.2,30.4 | 36.2,30.4 v36.2,31.8 | v11.36,28.6 7.28,28.6 ICSP.1 | v30.5,30.4 36.2,30.4
  Top 0.406: U$3.5 J5.5 40.06,41.32 DIGITAL~.4
  Bottom 0.152: v36.2,31.8 40.04,35.64 DIGITAL~.4 | v11.36,28.6 28.7,28.6 v30.5,30.4
MOSI  (via drill 0.25)
  Top 0.152: v36.2,33.1 36.3,33.1 37,32.4 U1.15 | v13.5,34.9 3.7,34.9 2.9,34.1 2.9,31.8 4.11,30.59 ICSP.4
  Top 0.406: U$3.4 J5.4 37.52,41.32 DIGITAL~.5
  Bottom 0.152: DIGITAL~.5 36.2,40 v36.2,33.1 36,33.3 35.79,33.3 35.73,33.24 35.27,33.24 35.21,33.3 15.2,33.3 13.6,34.9 v13.5,34.9
N$1  (via drill 0.25)
  Top 0.152: Y1.3 26.08,33.54 C2.2 26.3,33.84 v26.3,34.88 | U1.7 44.28,28.08 44.45,28.25 44.45,32.35 39.71,37.09 v27,37.09
  Bottom 0.152: v27,37.09 26.3,36.39 v26.3,34.88
N$2  (via drill 0.25)
  Top 0.152: Y1.1 28.38,26.35 C1.1 28.23,25.17 28.7,24.7 28.76,24.76 v33.5,24.76 | v39.84,28.66 40.06,28.88 U1.8
  Bottom 0.152: v33.5,24.76 38.06,24.76 39.84,26.54 v39.84,28.66
N$3
  Top 0.305: LED.C 53.15,39.8 R3.2
N$4  (via drill 0.25, 0.35)
  Top 0.152: R2.2 30.2,16.2 30.81,16.81 32.48,16.81 32.49,16.79 32.91,16.79 32.92,16.81 v35,16.81 | D3.C v40.8,15.9
  Bottom 0.152: v35,16.81 40.39,16.81 40.8,16.4 v40.8,15.9
N$5  (via drill 0.25)
  other vias: 48.6,26.9
N$6  (via drill 0.25)
  other vias: 49.8,25.7
N$7  (via drill 0.25)
  other vias: 51.8,15.1
N$9  (via drill 0.25)
  other vias: 30.4,27.4
N$12  (via drill 0.25)
  other vias: 26.1,7.7
N$13  (via drill 0.25)
  other vias: 58.5,28.3
N$14  (via drill 0.25)
  other vias: 58.5,27.5
N$15  (via drill 0.25)
  other vias: 59.5,34.3
N$16  (via drill 0.25)
  other vias: 59.5,33.3
N$18
  Top 0.152: IC3.16 60.38,37.37 R15.1
N$19
  Top 0.152: IC3.10 IC3.11 63.55,32.35 63.2,32 62,32 61.7,31.7 61.7,30.04 IC3.3 61.65,28.3 C10.1
N$20
  Top 0.152: U$16.D+ 67.21,32.71 66.55,32.05 R16.1
N$21
  Top 0.152: U$16.D- 69.76,32.06 70,32.3 70,37.1 69.7,37.4 R17.1
N$22  (via drill 0.25)
  other vias: 65.6,33.2
N$24  (via drill 0.25)
  other vias: 28.9,23.9
N$25  (via drill 0.25)
  other vias: 28.9,21.1
N$26  (via drill 0.25)
  other vias: 26,23.9
N$27  (via drill 0.25)
  other vias: 26,21.2
N$29  (via drill 0.25)
  other vias: 52.3,51.7
N$30  (via drill 0.25)
  other vias: 55.2,51.6
N$31  (via drill 0.25)
  other vias: 57.9,51.5
N$32  (via drill 0.25)
  other vias: 60.9,51.5
N$33  (via drill 0.25)
  other vias: 64.4,51.5
N$36  (via drill 0.25)
  other vias: 47.2,14.9
N$37  (via drill 0.25)
  other vias: 45.1,15
N$38  (via drill 0.25)
  other vias: 26.3,25.1
N$39  (via drill 0.25)
  other vias: 25.3,26.1
PB0  (via drill 0.25)
  Top 0.152: U1.12 39.4,34.2 38.8,34.8 30.93,34.8 v30.9,34.83
  Top 0.406: U$3.1 J5.1 29.9,41.32 DIGITAL~.8
  Bottom 0.152: v30.9,34.83 29.88,35.85 DIGITAL~.8
PB1  (via drill 0.25)
  Top 0.152: U1.13 38.7,30.47 38.7,33.7 38,34.4 33.66,34.4 v33.5,34.24
  Top 0.406: DIGITAL~.7 32.42,44.68 J5.2 U$3.2
  Bottom 0.152: v33.5,34.24 32.42,35.32 DIGITAL~.7
PB2  (via drill 0.25)
  Top 0.152: U1.14 37.9,30.47 37.9,33.3 37.4,33.8 v35.5,33.8
  Top 0.406: U$3.3 J5.3 34.98,41.32 DIGITAL~.6
  Bottom 0.152: v35.5,33.8 34.96,34.34 DIGITAL~.6
PC0  (via drill 0.25)
  Top 0.152: U1.23 34.63,24 33,24 31.94,22.94 v31.94,17.9
  Top 0.305: ANALOG.6 5.99,8.39 J4.6 5.9,3.7 ANALOG~3.1
  Bottom 0.152: v31.94,17.9 8.8,17.9 5.99,15.09 ANALOG.6
PC1  (via drill 0.25)
  Top 0.152: U1.24 33.18,23.28 32.9,23 32.9,17.5 v32.7,17.3
  Top 0.305: ANALOG.5 8.53,8.39 J4.5 8.44,3.7 ANALOG~3.2
  Bottom 0.152: v32.7,17.3 11.8,17.3 8.53,14.03 ANALOG.5
PC2  (via drill 0.25)
  Top 0.152: U1.25 v36.2,16.3
  Top 0.305: ANALOG.4 11.07,8.39 J4.4 10.98,3.7 ANALOG~3.3
  Bottom 0.152: v36.2,16.3 13.7,16.3 11.1,13.7 11.1,11.33 ANALOG.4
PC3  (via drill 0.25)
  Top 0.152: U1.26 37,15.5 v36.9,15.4
  Top 0.305: ANALOG.3 13.61,8.39 J4.3 13.52,3.7 ANALOG~3.4
  Bottom 0.152: v36.9,15.4 15.4,15.4 13.6,13.6 13.61,13.59 ANALOG.3
PC4  (via drill 0.25)
  Top 0.152: U1.27 37.8,14.8 v37.5,14.5
  Top 0.305: ANALOG.2 16.15,8.39 J4.2 16.06,3.7 ANALOG~3.5
  Bottom 0.152: v37.5,14.5 17.2,14.5 16.15,13.45 ANALOG.2
PC5  (via drill 0.25)
  Top 0.152: U1.28 v38.6,13.6
  Top 0.305: ANALOG.1 18.69,8.39 J4.1 18.6,3.7 ANALOG~3.6
  Bottom 0.152: ANALOG.1 18.8,11.41 18.8,12.7 19.7,13.6 v38.6,13.6
PD2  (via drill 0.25)
  Top 0.152: U1.32 41.8,18.8 v41.7,18.7
  Top 0.406: U$4.3 J3.3 9.48,40.92 DIGITAL.3
  Bottom 0.152: v41.7,18.7 41.5,18.5 11.2,18.5 9.6,20.1 9.6,40.8 DIGITAL.3
PD3  (via drill 0.25)
  Top 0.152: U1.1 44.38,23.28 45.3,24.2 45.3,32.9 39.8,38.4 12.7,38.4 v12.7,38.5
  Top 0.406: U$4.4 J3.4 12.02,40.92 DIGITAL.4
  Bottom 0.152: v12.7,38.5 12.04,39.16 DIGITAL.4
PD4  (via drill 0.25)
  Top 0.152: U1.2 44.28,24.08 44.7,24.5 44.7,32.6 39.7,37.6 15.3,37.6 v15.1,37.8
  Top 0.406: U$4.5 J3.5 14.56,40.92 DIGITAL.5
  Bottom 0.152: v15.1,37.8 14.58,38.32 DIGITAL.5
PD5  (via drill 0.25)
  Top 0.152: U1.9 41.8,34.2 39.5,36.5 v18.9,36.5
  Top 0.406: U$4.6 J3.6 17.1,41.4 17.12,41.38 DIGITAL.6
  Bottom 0.152: v18.9,36.5 17.5,36.5 17.12,36.88 DIGITAL.6
PD6  (via drill 0.25)
  Top 0.152: U1.10 41,34 39.06,35.94 v20.4,35.94
  Top 0.406: U$4.7 J3.7 19.64,40.92 DIGITAL.7
  Bottom 0.152: v20.4,35.94 19.66,36.68 DIGITAL.7
PD7  (via drill 0.25)
  Top 0.152: U1.11 40.1,30.47 40.1,34.2 38.91,35.39 v22.6,35.39
  Top 0.406: U$4.8 J3.8 22.18,40.92 DIGITAL.8
  Bottom 0.152: v22.6,35.39 22.2,35.79 DIGITAL.8
RESET  (via drill 0.25)
  Top 0.152: R1.1 39.41,21.78 U1.29 39.4,23.8 v39,24.2 | v13.5,33.7 7.3,33.7 ICSP.5 | RST.1 63.35,25.45 v63.3,25.4
  Bottom 0.152: v13.5,33.7 14.2,33 14.2,29.9 14.9,29.2 27.6,29.2 28.14,29.74 28.14,29.75 29.49,31.1 31.2,31.1 31.7,30.6 31.7,24.7 32.2,24.2 v39,24.2 62.1,24.2 v63.3,25.4
RXD  (via drill 0.25)
  Top 0.152: U1.30 40.2,19.86 v40.1,19.86 | v10.76,37.1 10.46,37.4 5.4,37.4 v5.3,37.5 | v47.6,22.3 47.56,22.27 44.47,22.27 43.7,21.5 v43.7,20 | v49.7,22.3 51.2,22.3 52,23.1 v52,26.4 52,33.3 52.3,33.6 TX.A | IC3.4 62.28,26.78 62,26.5 61.8,26.5 v61.7,26.4
  Top 0.406: U$4.1 J3.1 4.4,40.92 DIGITAL.1
  Bottom 0.152: v10.76,37.1 10.8,37.06 10.8,21.2 12.14,19.86 v40.1,19.86 40.24,20 v43.7,20 | v5.3,37.5 4.42,38.38 DIGITAL.1 | v49.7,22.3 v47.6,22.3 | v61.7,26.4 v52,26.4
SCK  (via drill 0.25, 0.35)
  Top 0.152: ICSP.3 7.44,31.3 v13.4,31.3 | v28.7,29.52 31.18,29.52 31.82,28.88 U1.17 34.73,28.9 v36.8,28.9 | DIGITAL~.3 42.58,39.32 42.8,39.1 49,39.1 49.3,38.8 49.3,37 49.5,36.8 LED.A
  Top 0.406: U$3.6 J5.6 42.6,41.32 DIGITAL~.3
  Bottom 0.152: DIGITAL~.3 42.58,32.18 39.3,28.9 v36.8,28.9 | v28.7,29.52 28.62,29.52 28,28.9 14.6,28.9 13.6,29.9 13.6,31.1 v13.4,31.3
TXD  (via drill 0.25)
  Top 0.152: U1.31 v41,19.3 | v10.2,38 10,38.2 8,38.2 v8,38.1 | v43.7,19.2 52.6,19.2 53.1,19.7 53.1,28.9 | RX.A 53.1,28.9 | IC3.1 60.38,29.18 60.1,28.9 53.1,28.9
  Top 0.406: U$4.2 J3.2 6.94,40.92 DIGITAL.2
  Bottom 0.152: v10.2,38 10.2,20.5 11.4,19.3 v41,19.3 43.6,19.3 v43.7,19.2 | v8,38.1 7.5,38.1 6.96,38.64 DIGITAL.2
VCC  (via drill 0.25)
  Top 0.152: C3.1 32.05,27.75 32.38,28.08 U1.18 40.82,28.08 41.62,27.28 U1.6 43.31,27.3 44.2,27.3 44.4,27.1 44.4,25.9 44.18,25.68 U1.4 | R1.2 39.41,13.21 39.1,12.9 36.4,12.9 v36.25,13.05 | v24.98,13.04 23.74,13.04 23.45,12.75 U$8.B | C9.1 47,25.85 47,37.3 47.6,37.9 v48.6,37.9 | v62.4,37.8 62.92,37.28 IC3.12 62.92,32.92 v62.9,32.9 | v67.2,31.4 68.73,31.4 U$16.V-BUS
  Top 0.305: R1.2 41.21,16.71 v42.2,17.7 | C9.1 46.8,25.65 v46.8,23.3 46.1,22.6 42.26,22.6 42.19,22.68 42.1,22.68 40.9,23.6 40.9,25.1 41.48,25.68 U1.4 | ICSP.2 2.4,26.26 2.4,10.4 v3.1,9.7 | v25.6,8.4 24.5,9.5 U$8.VCC
  Top 0.406: U$8.B 23.45,10.45 U$8.VCC
  Bottom 0.152: v36.25,13.05 v24.99,13.05 v24.98,13.04 | v48.6,37.9 62.3,37.9 v62.4,37.8 | v62.9,32.9 62.9,31.9 63.4,31.4 v67.2,31.4
  Bottom 0.305: v42.2,17.7 46.1,17.7 46.8,18.4 v46.8,23.3 | v25.6,8.4 24.3,9.7 19.29,9.7 19.11,9.52 5.57,9.52 5.39,9.7 v3.1,9.7
X-OR-5V-OUT  (via drill 0.25)
  Top 0.152: C8.1 27.2,10.4 27,10.6 v26.4,10.6 | v22.77,10.6 22.5,10.33 U$8.Y | 43.78,14.88 U$9.IN
  Top 0.305: J2.VBUS 52.35,7 41.48,7 J1.3
  Top 0.406: U$9.IN 43.9,13 JP1.4 J1.4 | JP1.3 40.1,8.42 J1.3 | D3.A 43.78,14.88
  Bottom 0.152: v22.77,10.6 v26.4,10.6 29.1,10.6 29.3,10.4 29.3,2.7 29.8,2.2 41.12,2.2 U$10.4
  Bottom 0.406: U$10.3 39.98,8.3 J1.3 J1.4 42.52,8.3 U$10.4

### Text on the board
tNames: v1 (c) 2019 | https://www.skndungudevs.com/ | TX | 0 | RX | 1 | 2 | ~ | 3 | 4 | ~ | 5 | ~ | 6 | 7 | DIGITAL (PWM~) | 8 | ~ | 9 | 10 | ~ | 11 | ~ | 12 | 13 | GND | AREF | 5V OUT | ANALOG IN | A0 | A1 | A2 | A3 | A4 | A5 | GND | GND | 5V | POWER | 5V | 3V3 | 12V OUT | 12V OUT | 12V OUT | 12V IN
bNames: https://www.skndungudevs.com/ | skndungu pcb designs